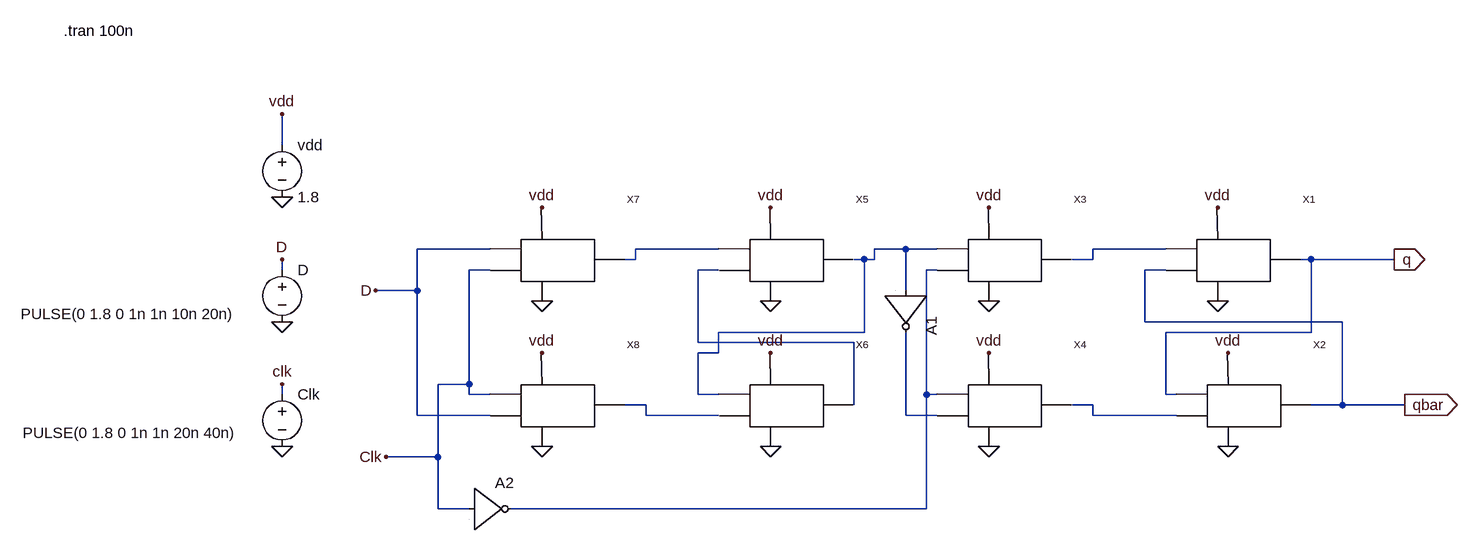
[diagram p0: schematic Dflipflop.asc]
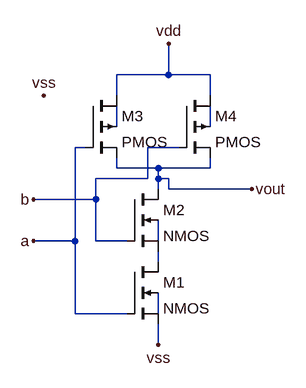
[diagram p1: sub-circuit nand.asc]
Dflipflop.asc, the LTspice schematic file:
Version 4.1
SHEET 1 880 680
WIRE -992 -112 -992 -160
WIRE -672 48 -784 48
WIRE -320 48 -448 48
WIRE -32 48 -80 48
WIRE 16 48 -32 48
WIRE 368 48 256 48
WIRE -448 64 -448 48
WIRE -448 64 -464 64
WIRE -96 64 -112 64
WIRE -80 64 -80 48
WIRE -80 64 -96 64
WIRE 256 64 256 48
WIRE 256 64 224 64
WIRE 592 64 576 64
WIRE 720 64 592 64
WIRE -992 80 -992 64
WIRE -672 80 -704 80
WIRE -320 80 -352 80
WIRE 16 80 0 80
WIRE 368 80 336 80
WIRE -784 112 -784 48
WIRE -784 112 -848 112
WIRE -32 112 -32 48
WIRE 336 160 336 80
WIRE 640 160 336 160
WIRE -96 176 -96 64
WIRE -96 176 -320 176
WIRE 592 176 592 64
WIRE 592 176 368 176
WIRE -352 192 -352 80
WIRE -112 192 -352 192
WIRE -320 208 -320 176
WIRE -320 208 -352 208
WIRE -704 256 -704 80
WIRE -704 256 -752 256
WIRE -992 272 -992 256
WIRE -704 272 -704 256
WIRE -672 272 -704 272
WIRE -352 272 -352 208
WIRE -320 272 -352 272
WIRE 0 272 0 80
WIRE 16 272 0 272
WIRE 368 272 368 176
WIRE 384 272 368 272
WIRE -432 288 -464 288
WIRE -112 288 -112 192
WIRE 256 288 224 288
WIRE 640 288 640 160
WIRE 640 288 592 288
WIRE 736 288 640 288
WIRE -784 304 -784 112
WIRE -672 304 -784 304
WIRE -432 304 -432 288
WIRE -320 304 -432 304
WIRE -32 304 -32 176
WIRE 16 304 -32 304
WIRE 256 304 256 288
WIRE 384 304 256 304
WIRE -752 368 -752 256
WIRE -752 368 -832 368
WIRE -752 448 -752 368
WIRE -704 448 -752 448
WIRE 0 448 0 272
WIRE 0 448 -640 448
FLAG 720 64 q
IOPIN 720 64 Out
FLAG 736 288 qbar
IOPIN 736 288 Out
FLAG 448 128 0
FLAG 464 352 0
FLAG 96 352 0
FLAG 96 128 0
FLAG -240 128 0
FLAG -240 352 0
FLAG -592 352 0
FLAG -592 128 0
FLAG -592 208 vdd
FLAG -592 -16 vdd
FLAG -240 -16 vdd
FLAG 96 -16 vdd
FLAG 448 -16 vdd
FLAG 464 208 vdd
FLAG 96 208 vdd
FLAG -240 208 vdd
FLAG -992 -160 vdd
FLAG -992 64 D
FLAG -992 256 clk
FLAG -848 112 D
FLAG -832 368 Clk
FLAG -992 -32 0
FLAG -992 160 0
FLAG -992 352 0
SYMBOL nand 464 64 R0
SYMATTR InstName X1
SYMBOL nand 480 288 R0
SYMATTR InstName X2
SYMBOL nand 112 64 R0
SYMATTR InstName X3
SYMBOL nand 112 288 R0
SYMATTR InstName X4
SYMBOL nand -224 64 R0
SYMATTR InstName X5
SYMBOL nand -224 288 R0
SYMATTR InstName X6
SYMBOL nand -576 64 R0
SYMATTR InstName X7
SYMBOL nand -576 288 R0
SYMATTR InstName X8
SYMBOL Digital\\inv 32 112 R90
SYMATTR InstName A1
SYMBOL voltage -992 -128 R0
SYMATTR InstName vdd
SYMATTR Value 1.8
SYMBOL voltage -992 64 R0
WINDOW 3 -402 84 Left 2
WINDOW 123 0 0 Left 0
WINDOW 39 0 0 Left 0
SYMATTR InstName D
SYMATTR Value PULSE(0 1.8 0 1n 1n 10n 20n)
SYMBOL voltage -992 256 R0
WINDOW 3 -399 75 Left 2
WINDOW 123 0 0 Left 0
WINDOW 39 0 0 Left 0
SYMATTR InstName Clk
SYMATTR Value PULSE(0 1.8 0 1n 1n 20n 40n)
SYMBOL Digital\\inv -704 384 R0
SYMATTR InstName A2
TEXT -1328 -288 Left 2 !.tran 100n

nand.asc, the sub-circuit schematic file:
Version 4.1
SHEET 1 880 680
WIRE 192 -32 192 -80
WIRE 192 -32 112 -32
WIRE 256 -32 192 -32
WIRE 112 0 112 -32
WIRE 256 0 256 -32
WIRE 112 48 112 16
WIRE 256 48 256 16
WIRE 64 80 48 80
WIRE 208 80 160 80
WIRE 112 112 112 96
WIRE 176 112 112 112
WIRE 256 112 256 96
WIRE 256 112 176 112
WIRE 160 128 160 80
WIRE 160 128 80 128
WIRE 176 128 176 112
WIRE 192 128 176 128
WIRE 176 144 176 128
WIRE 192 144 192 128
WIRE 320 144 192 144
WIRE 80 160 80 128
WIRE 80 160 -16 160
WIRE 48 224 48 80
WIRE 48 224 -16 224
WIRE 80 224 80 160
WIRE 128 224 80 224
WIRE 176 224 176 192
WIRE 176 256 176 240
WIRE 48 336 48 224
WIRE 128 336 48 336
WIRE 176 336 176 304
WIRE 176 384 176 352
FLAG -16 224 a
FLAG -16 160 b
FLAG 192 -80 vdd
FLAG 320 144 vout
FLAG 176 384 vss
FLAG 0 0 vss
SYMBOL nmos4 128 256 R0
SYMATTR InstName M1
SYMBOL nmos4 128 144 R0
SYMATTR InstName M2
SYMBOL pmos4 64 0 R0
SYMATTR InstName M3
SYMBOL pmos4 208 0 R0
SYMATTR InstName M4

The netlist it stands for:
* Dflipflop.asc
X§X1 N003 qbar vdd 0 q nand
X§X2 q N007 vdd 0 qbar nand
X§X3 N002 N005 vdd 0 N003 nand
X§X4 N005 N008 vdd 0 N007 nand
X§X5 N001 N004 vdd 0 N002 nand
X§X6 N002 N006 vdd 0 N004 nand
X§X7 D clk vdd 0 N001 nand
X§X8 clk D vdd 0 N006 nand
A1 N002 0 0 0 0 N008 0 0 BUF
vdd vdd 0 1.8
V§D D 0 PULSE(0 1.8 0 1n 1n 10n 20n)
V§Clk clk 0 PULSE(0 1.8 0 1n 1n 20n 40n)
A2 clk 0 0 0 0 N005 0 0 BUF

* block symbol definitions
.subckt nand a b vdd vss vout
M1 N004 a vss N005 NMOS
M2 vout b N004 N003 NMOS
M3 vdd a vout N001 PMOS
M4 vdd b vout N002 PMOS
.ends nand

.model NMOS NMOS
.model PMOS PMOS
.lib standard.mos
.tran 100n
.backanno
.end